# Altium project pira-smart-PCB.PrjPcb (part 2 of 3)
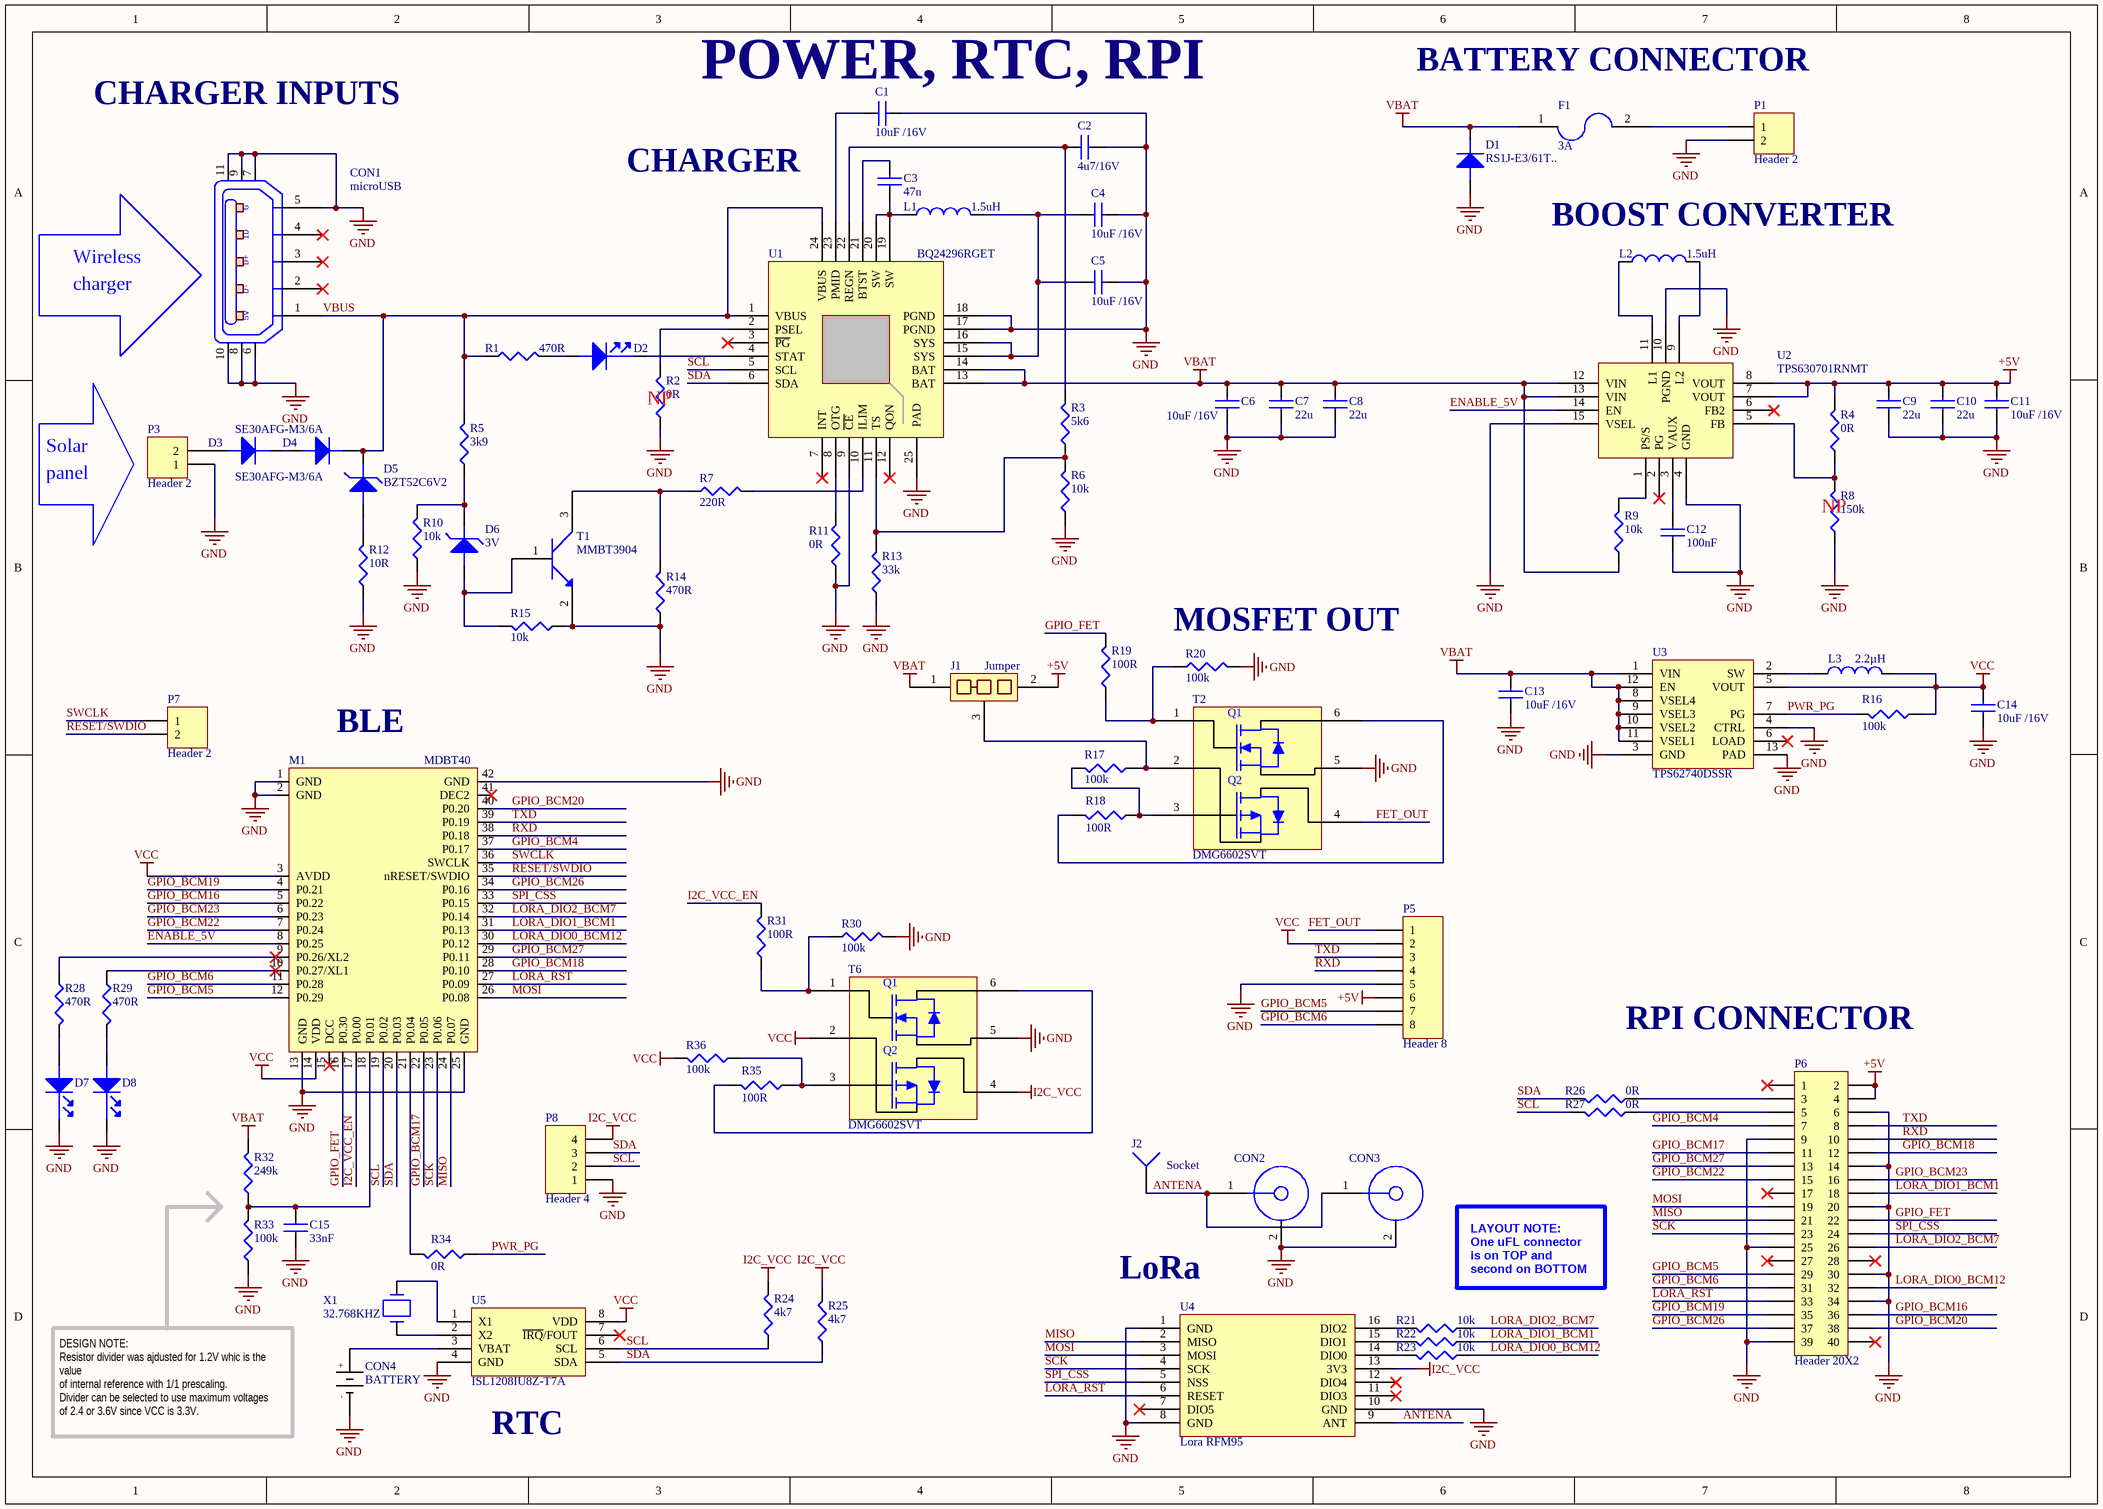
[diagram p2: PAGE2-BLE, POWER, LORA.SchDoc]

## Sheet PAGE2-BLE, POWER, LORA.SchDoc (continued)
### Library data of the parts
C1 C4-C6 C11 C13 C14 = 10uF /16V: TDK - CGA4J1X5R1C106K125AC - CAP, MLCC, X5R, 10UF, 16V, 0805; Manufacturer: TDK; Manufacturer Part Number: CGA4J1X5R1C106K125AC; RoHS: YES; ComponentLink1URL: http://bcove.me/e1v54mtm; ComponentLink1Description: http://bcove.me/e1v54mtm; ComponentLink2URL: http://www.farnell.com/datasheets/1936565.pdf; ComponentLink2Description: http://www.farnell.com/datasheets/1936565.pdf; ComponentLink3URL: http://www.farnell.com/datasheets/1683658.pdf; ComponentLink3Description: http://www.farnell.com/datasheets/1683658.pdf; Supplier 1: Farnell
  C1 C4-C6 C11: Supplier Part Number 1: 2320856
  C13 C14: Stock 1: 8974; Pricing 1: 5=0.41, 50=0.146, 250=0.131, 500=0.12, 1000=0.103 (GBP); Supplier Part Number 1: 2210948RL
C2 = 4u7  16V 0603: MURATA - GRM188R61C475KAAJD - CAP, MLCC, X5R, 4.7UF, 16V, 0603; Ceramic Capacitor Case: 0603 [1608 Metric]; Capacitance: 4.7; Voltage Rating: 16; Capacitance Tolerance: ± 10%; Dielectric Characteristic: X5; Product Range: GRM Series; SVHC: No SVHC (17-Dec-2015)<!--FANDB--><div class="features-and-benefits-container"><div class="features-and-benefits-desc-container"><span class="features-and-benefits-container-desc">SMD Multilayer Ceramic Capacitor, 0603 [1608 Metric], 4.7 µF, 16 V, ± 10%, X5; Supplier 1: Farnell; Manufacturer: MURATA; Manufacturer Part Number: GRM188R61C475KAAJD; RoHS: YES; Stock 1: 5038; Pricing 1: 10=0.16, 100=0.0929, 500=0.076, 1000=0.0618, 2000=0.0605, 4000=0.0425, 20000=0.0409, 40000=0.0355 (GBP); Packaging: Cut Tape; Operating Temperature Min: -55; Operating Temperature Max: 85; Automotive Qualification Standard: -; MSL: MSL 1 - Unlimited; ComponentLink1URL: http://www.farnell.com/datasheets/2079168.pdf; ComponentLink1Description: http://www.farnell.com/datasheets/2079168.pdf; Supplier Part Number 1: 2611924
C3 = 47nF / 50V: MULTICOMP - MC0603B473K500CT - CAP, MLCC, X7R, 47NF, 50V, 0603; Supplier 1: Farnell; Manufacturer: MULTICOMP; Manufacturer Part Number: MC0603B473K500CT; RoHS: YES; Stock 1: 34893; Pricing 1: 10=0.0102, 100=0.0086, 500=0.0069, 1000=0.0059, 2000=0.0051 (GBP); ComponentLink1URL: http://www.farnell.com/datasheets/1901289.pdf; ComponentLink1Description: http://www.farnell.com/datasheets/1901289.pdf; Supplier Part Number 1: 1759116
C7-C10 = 22u 6.3V 0805: MULTICOMP - MC0805X226M6R3CT - CAP, MLCC, X5R, 22UF, 0805; Ceramic Capacitor Case: 0805 [2012 Metric]; Capacitance: 22; Voltage Rating: 6.3; Capacitance Tolerance: ± 20%; Dielectric Characteristic: X5; Product Range: MC Series; SVHC: No SVHC (07-Jul-2017); Capacitor Terminals: SMD; Supplier 1: Farnell; Manufacturer: MULTICOMP; Manufacturer Part Number: MC0805X226M6R3CT; RoHS: YES; Stock 1: 74736; Pricing 1: 5=0.128, 50=0.0738, 250=0.0507, 500=0.042, 1500=0.0358 (GBP); Packaging: Cut Tape; Operating Temperature Min: -55; Operating Temperature Max: 85; Automotive Qualification Standard: -; MSL: -; Capacitance Tolerance ±: ± 20%; Operating Temperature Range: -55°C to +85°C<!--FANDB--><div class="features-and-benefits-container"><div class="features-and-benefits-desc-container"><span class="features-and-benefits-container-desc">SMD Multilayer Ceramic Capacitor, 0805 [2012 Metric], 22 µF, 6.3 V, ± 20%, X5R, MC Series</span></div><div class="features-and-benefits-description"><span class="features-benefits-value">The Multicomp MC series is general purpose MLCC capacitors with X5R dielectric material which provides high electrical precision, stability and reliability. This MLCC capacitor consists of a conducting material and electrodes with high density and high efficiency ceramic condensers.</span></div><div class="features-and-benefits-list"><ul class="features-and-benefits-list-list"><li class="features-and-benefits-list-item">Small size with higher capacitance values</li><li class="features-and-benefits-list-item">0201, 0402, 0603, 0805, 1206, 1210, 1812 case sizes available</li><li class="features-and-benefits-list-item">Capacitance value ranging from 100pF to 220?F</li><li class="features-and-benefits-list-item">Capacitor with lead free termination (pure Tin)</li><li class="features-and-benefits-list-item">High electrical precision, stability and reliability</li><li class="features-and-benefits-list-item">Rated voltage of 4V, 6.3V, 10V, 16V, 25V, 50V</li><li class="features-and-benefits-list-item">Operating temperature of -55°C to +85°C</li><li class="features-and-benefits-list-item">Available in ±10% and ±20; ComponentLink1URL: http://www.farnell.com/datasheets/1901289.pdf; ComponentLink1Description: http://www.farnell.com/datasheets/1901289.pdf; ComponentLink2URL: http://www.farnell.com/datasheets/1932399.pdf; ComponentLink2Description: http://www.farnell.com/datasheets/1932399.pdf; Supplier Part Number 1: 1759415
C12 = 100nF: MURATA - GRM188R71C104KA01J - CAP, MLCC, X7R, 0.1UF, 16V, 0603; Ceramic Capacitor Case: 0603 [1608 Metric]; Capacitance: 0.1; Voltage Rating: 16; Capacitance Tolerance: ± 10%; Dielectric Characteristic: X7; Product Range: GRM Series; SVHC: No SVHC (20-Jun-2016; Supplier 1: Farnell; Manufacturer: MURATA; Manufacturer Part Number: GRM188R71C104KA01J; RoHS: YES; Stock 1: 18297; Pricing 1: 10=0.0145, 100=0.0126, 500=0.0081, 2500=0.0059, 5000=0.0052, 10000=0.0046, 50000=0.0036, 100000=0.0035 (GBP); Packaging: Cut Tape; Operating Temperature Min: -55; Operating Temperature Max: 125; Automotive Qualification Standard: -; MSL: MSL 1 - Unlimited; ComponentLink1URL: http://www.farnell.com/datasheets/2189124.pdf; ComponentLink1Description: http://www.farnell.com/datasheets/2189124.pdf; Supplier Part Number 1: 2688519
C15 = 33nF: MULTICOMP   MC0603B333K250CT   Multilayer Ceramic Capacitor, MC Series, 0.033 F,  10%, X7R, 25 V, 0603 [1608 Metric]; SVHC: To Be Advised; Voltage Rating: 25V; Capacitor Terminals: SMD; Supplier 1: Farnell; Manufacturer: Multicomp; Manufacturer Part Number: MC0603B333K250CT; Stock 1: 9606; Pricing 1: 10=0.0225, 100=0.0163, 500=0.0101, 1000=0.0083, 2000=0.007 (EUR); Capacitance: 33nF; Capacitance Tolerance: ± 10%; Dielectric Characteristic: X7R; Capacitor Case Style: 0603 [1608 Metric]; Operating Temperature Min: -55°C; Operating Temperature Max: 125°C; Packaging: Full Reel; MSL: (Not Available); ComponentLink1URL: https://datasheet.ciiva.com/22675/1901289-22675775.pdf; ComponentLink1Description: https://datasheet.ciiva.com/22675/1901289-22675775.pdf
CON1 = Micro USB CHINA 1
CON2 CON3 = U.FL-R-SMT-1(10): HIROSE(HRS) - U.FL-R-SMT-1(10) - RF COAXIAL, U.FL, STRAIGHT JACK, 50OHM; Connector Type: U.FL Coaxial; Coaxial Termination: Surface Mount Vertical; Impedance: 50; Frequency Max: 6; Connector Mounting: PCB Mount; Supplier 1: Farnell; Manufacturer: HIROSE(HRS); Manufacturer Part Number: U.FL-R-SMT-1(10); RoHS: YES; Stock 1: 118146; Pricing 1: 1=0.5, 25=0.49, 100=0.468, 150=0.446, 250=0.424, 1000=0.394 (GBP); Connector Body Style: Straight Jack; Coaxial Cable Types: -; Contact Material: Brass; Contact Plating: Gold Plated Contacts; Product Range: -; Operating Temperature Max: 90; Operating Temperature Min: -40°C<!--FANDB--><div class="features-and-benefits-container"><div class="features-and-benefits-description"><span class="features-benefits-value">The U. FL-R-SMT-1(10) from Hirose is a straight ultra miniature SMT coaxial receptacle. These connectors offer high frequency performance from DC to 6GHz and impedance of 50 ohm to meet the frequency requirements of a wide variety of miniature equipments.</span></div><div class="features-and-benefits-list"><ul class="features-and-benefits-list-list"><li class="features-and-benefits-list-item">Phosphor bronze with gold plated contacts</li><li class="features-and-benefits-list-item">LCP insulator</li><li class="features-and-benefits-list-item">VSWR of 1.3max at 0 to 3GHz</li><li class="features-and-benefits-list-item">Operating temperature range from -40°C to 90; ComponentLink1URL: http://www.farnell.com/cad/2110742.pdf; ComponentLink1Description: http://www.farnell.com/cad/2110742.pdf; ComponentLink2URL: http://bcove.me/8op6hfnt; ComponentLink2Description: http://bcove.me/8op6hfnt; ComponentLink3URL: http://www.farnell.com/datasheets/1947917.pdf; ComponentLink3Description: http://www.farnell.com/datasheets/1947917.pdf; ComponentLink4URL: http://www.farnell.com/cad/2115175.stp; ComponentLink4Description: http://www.farnell.com/cad/2115175.stp; Supplier Part Number 1: 1688077
CON4 = 1066: HOLDER BATT COIN COMPACT 20MM; Manufacturer: Keystone Electronics; Body Material: Nylon,Glass; Number of Batteries: 1; Approvals: UL; Supplier 1: Farnell; Manufacturer Part Number: 1066; Stock 1: 17073; Pricing 1: 1=1, 50=0.97, 100=0.947, 500=0.927, 1000=0.847 (EUR); Mount: Through Hole,Holder,PCB; Contact Plating: Tin; Contact Material: Bronze,Copper,Tin; Material: Bronze; Min Operating Temperature: -50°C; Max Operating Temperature: 145°C; Packaging: Bulk; Number of Cells: 1; Package Quantity: 1; Termination: PC Pin; Diameter: 20mm; REACH SVHC: No SVHC; Lead Free: Lead Free; ComponentLink1URL: https://datasheet.ciiva.com/3/1066-3994.pdf; ComponentLink1Description: https://datasheet.ciiva.com/3/1066-3994.pdf; ComponentLink2URL: https://datasheet.ciiva.com/1391/1718229-1391198.pdf; ComponentLink2Description: https://datasheet.ciiva.com/1391/1718229-1391198.pdf; ComponentLink3URL: https://datasheet.ciiva.com/12342/m60p3-4068-12342995.pdf; ComponentLink3Description: https://datasheet.ciiva.com/12342/m60p3-4068-12342995.pdf; ComponentLink4URL: https://datasheet.ciiva.com/18403/70181436-18403177.pdf; ComponentLink4Description: https://datasheet.ciiva.com/18403/70181436-18403177.pdf; ComponentLink5URL: https://datasheet.ciiva.com/22643/1814063-22643020.pdf; ComponentLink5Description: https://datasheet.ciiva.com/22643/1814063-22643020.pdf; ComponentLink6URL: https://datasheet.ciiva.com/16322/m60-2p3-16322780.pdf; ComponentLink6Description: https://datasheet.ciiva.com/16322/m60-2p3-16322780.pdf; Supplier Part Number 1: 2293258
D1 = RS1J-E3/61T..: VISHAY - RS1J-E3/61T.. - DIODE, FAST, 1A, 600V, SMD; Repetitive Reverse Voltage Vrrm Max: 600; Forward Current If(AV): 1; Diode Configuration: Single; Forward Voltage VF Max: 1.3; Reverse Recovery Time trr Max: 250; Forward Surge Current Ifsm Max: 30; Diode Case Style: DO-214; No. of Pins: 2 Pin; Product Range: RS1; SVHC: No SVHC (15-Jun-2015); Diode Type: Fast Recovery; External Depth: 2.79; External Length / Height: 2.29; External Width: 5.28; Junction Temperature Tj Max: 150; Supplier 1: Farnell; Manufacturer: VISHAY; Manufacturer Part Number: RS1J-E3/61T..; RoHS: YES; Stock 1: 4705; Pricing 1: 10=0.164, 100=0.111, 200=0.093, 500=0.0847, 1000=0.083, 3000=0.0813, 9000=0.0796, 30000=0.0779 (GBP); Operating Temperature Max: 150; Packaging: Cut Tape; Automotive Qualification Standard: -; Alternate Case Style: DO-214; Current Ifsm: 30; Forward Current If Max: 1; Forward Voltage: 1.3; Operating Temperature Min: -55; Operating Temperature Range: -55°C to +150; Tape Width: 12mm<!--FANDB--><div class="features-and-benefits-container"><div class="features-and-benefits-desc-container"><span class="features-and-benefits-container-desc">Fast / Ultrafast Diode, 600 V, 1 A, Single, 1.3 V, 250 ns, 30 A</span></div><div class="features-and-benefits-description"><span class="features-benefits-value">The RS1J-E3/5AT is a surface-mount Fast Switching Rectifier with solderable matte tin-plated terminals. It is suitable for use in fast switching rectification of power supply, inverters, converters and freewheeling diodes.</span></div><div class="features-and-benefits-list"><ul class="features-and-benefits-list-list"><li class="features-and-benefits-list-item">Colour band denotes cathode end</li><li class="features-and-benefits-list-item">Low-profile package</li><li class="features-and-benefits-list-item">Ideal for automated placement</li><li class="features-and-benefits-list-item">Glass-passivated pallet chip junction</li><li class="features-and-benefits-list-item">Fast switching for high efficiency</li><li class="features-and-benefits-list-item">High forward surge capability</li><li class="features-and-benefits-list-item">Meets MSL level 1 as per J-STD-020, LF maximum peak of 260°C</li><li class="features-and-benefits-list-item">AEC-Q101 qualified</li><li class="features-and-benefits-list-item">UL94V-0 Flammability rating</li></ul></div><div class="features-and-benefits-applications"><ul class="features-and-benefits-value"><li class="features-and-benefits-list-item">Power Management</li><li class="features-and-benefits-list-item">Consumer Electronics</li><li class="features-and-benefits-list-item">Commercial</li><li class="features-and-benefits-list-item">Communications & Networking</li><li class="features-and-benefits-list-item">Automotive</li></ul></div></div>; ComponentLink1URL: http://www.vishay.com/docs/88869/packagin.pdf; ComponentLink1Description: http://www.vishay.com/docs/88869/packagin.pdf; ComponentLink2URL: http://www.vishay.com/doc?88707; ComponentLink2Description: http://www.vishay.com/doc?88707; ComponentLink3URL: http://www.farnell.com/datasheets/2244878.pdf; ComponentLink3Description: http://www.farnell.com/datasheets/2244878.pdf; Supplier Part Number 1: 9550143
D2 D7 D8 = LED RED: BROADCOM LIMITED - HSMS-C190 - LED, RED, 10MCD, 626NM; LED Mounting: SMD; Forward Current If: 20; Forward Voltage: 2.1; Wavelength Typ: 626; Luminous Intensity: 10; Viewing Angle: 170°; Lens Shape: Rectangular; SVHC: No SVHC (17-Dec-2015)<!--FANDB--><div class="features-and-benefits-container"><div class="features-and-benefits-description"><span class="features-benefits-value">The HSMS-C190 is a HER SMD Chip LED with untinted/diffused lens, made of GaP. It is designed in an industry standard package 1.6 x 0.8mm footprint with 0.8mm profile. It is compatible with IR reflow solder processes. The small size and wide viewing angle make this LED prime choices for backlighting applications and front panel illumination especially where space is a premium.</span></div><div class="features-and-benefits-list"><ul class="features-and-benefits-list-list"><li class="features-and-benefits-list-item">Small size</li><li class="features-and-benefits-list-item">Industry standard footprint</li><li class="features-and-benefits-list-item">Compatible with IR solder</li><li class="features-and-benefits-list-item">Diffused optics</li><li class="features-and-benefits-list-item">-40 to 85; Supplier 1: Farnell; Manufacturer: BROADCOM LIMITED; Manufacturer Part Number: HSMS-C190; RoHS: YES; Stock 1: 7534; Pricing 1: 1=0.361, 10=0.256, 50=0.235, 100=0.106, 200=0.101 (GBP); LED Colour: Red; Bulb Size: -; Packaging: Cut Tape; Product Range: -; Automotive Qualification Standard: -; MSL: -; ComponentLink1URL: http://www.farnell.com/datasheets/313031.pdf; ComponentLink1Description: http://www.farnell.com/datasheets/313031.pdf; ComponentLink2URL: http://www.farnell.com/datasheets/1681524.pdf; ComponentLink2Description: http://www.farnell.com/datasheets/1681524.pdf; ComponentLink3URL: http://www.farnell.com/datasheets/2165483.pdf; ComponentLink3Description: http://www.farnell.com/datasheets/2165483.pdf; Supplier Part Number 1: 2497356
D3 D4 = SE30AFG-M3/6A: VISHAY - SE30AFG-M3/6A - RECTIFIER, ESD, 400V, 3A, DO-221AC; Repetitive Reverse Voltage Vrrm Max: 400; Forward Current If(AV): 3; Diode Configuration: Single; Forward Voltage VF Max: 1.1; Reverse Recovery Time trr Max: 1.5; Forward Surge Current Ifsm Max: 40; Diode Case Style: DO-221; No. of Pins: 2; Product Range: SE30; Diode Type: Standard Recovery; Supplier 1: Farnell; Manufacturer: VISHAY; Manufacturer Part Number: SE30AFG-M3/6A; RoHS: YES; Stock 1: 13984; Pricing 1: 1=0.306, 25=0.0765, 100=0.0753, 250=0.0729, 500=0.072, 1000=0.0654 (GBP); Operating Temperature Max: 175; Packaging: Each; Automotive Qualification Standard: -; MSL: MSL 1 - Unlimited; Operating Temperature Min: -55°C<!--FANDB--><div class="features-and-benefits-container"><div class="features-and-benefits-desc-container"><span class="features-and-benefits-container-desc">Standard Recovery Diode, 400 V, 3 A, Single, 1.1 V, 1.5 µs, 40 A</span></div><div class="features-and-benefits-description"><span class="features-benefits-value">The SE30AFG-M3/6A is a surface-mount ESD Capability Rectifier with matte tin-plated solderable leads. It is suitable for use in general-purpose, polarity protection and rail-to-rail protection.</span></div><div class="features-and-benefits-list"><ul class="features-and-benefits-list-list"><li class="features-and-benefits-list-item">Oxide planar chip junction</li><li class="features-and-benefits-list-item">Low forward voltage drop, low leakage current</li><li class="features-and-benefits-list-item">Very low profile - Typical height of 0.95; ComponentLink1URL: http://www.farnell.com/datasheets/2049981.pdf; ComponentLink1Description: http://www.farnell.com/datasheets/2049981.pdf; Supplier Part Number 1: 2313878
D5 = BZT52C6V2: DIODES INC. - BZT52C6V2 - DIODE, ZENER, 6.2V, 0.5W, SOD-123; Zener Voltage Vz Typ: 6.2; Power Dissipation Pd: 500; Zener Tolerance ±: 6%; No. of Pins: 2; Product Range: BZT52 Series; SVHC: No SVHC (12-Jan-2017); Supplier 1: Farnell; Manufacturer: DIODES INC.; Manufacturer Part Number: BZT52C6V2; RoHS: YES; Stock 1: 4408; Pricing 1: 1=0.415, 25=0.264, 100=0.0727, 250=0.0546, 500=0.047, 1000=0.0334, 3000=0.0278, 7000=0.0236 (GBP); Diode Case Style: SOD-123; Operating Temperature Max: 150; Packaging: Cut Tape; Automotive Qualification Standard: -; MSL: MSL 1 - Unlimited; Operating Temperature Min: -65; Operating Temperature Range: -65°C to +150°C<!--FANDB--><div class="features-and-benefits-container"><div class="features-and-benefits-desc-container"><span class="features-and-benefits-container-desc">Zener Single Diode, 6.2 V, 500 mW, SOD-123, 6 %, 2 Pins, 150 °C</span></div><div class="features-and-benefits-description"><span class="features-benefits-value">The BZT52C6V2 is a surface mount Zener Diode with moulded plastic case, matte tin annealed over Alloy 42 lead frame (lead-free plating) terminals and cathode band polarity. It is ideally suited for automated assembly processes.</span></div><div class="features-and-benefits-list"><ul class="features-and-benefits-list-list"><li class="features-and-benefits-list-item">Planar die construction</li><li class="features-and-benefits-list-item">500mW Power dissipation</li><li class="features-and-benefits-list-item">General purpose, medium current</li><li class="features-and-benefits-list-item">Totally lead-free</li><li class="features-and-benefits-list-item">Halogen and antimony-free - Green device</li><li class="features-and-benefits-list-item">Qualified to AEC-Q101 standards for high reliability</li></ul></div><div class="features-and-benefits-applications"><ul class="features-and-benefits-value"><li class="features-and-benefits-list-item">Automation & Process Control</li></ul></div></div>; ComponentLink1URL: http://www.farnell.com/datasheets/1670962.pdf; ComponentLink1Description: http://www.farnell.com/datasheets/1670962.pdf; Supplier Part Number 1: 1902438
D6 = MM3Z3V0T1G: ON SEMICONDUCTOR - MM3Z3V0T1G - ZENER DIODE, 200MW, 3V, SOD-323; Zener Voltage Vz Typ: 3; Power Dissipation Pd: 300; Zener Tolerance ±: 5%; No. of Pins: 2; Product Range: MM3Z3 Series; SVHC: No SVHC (07-Jul-2017); Supplier 1: Farnell; Manufacturer: ON SEMICONDUCTOR; Manufacturer Part Number: MM3Z3V0T1G; RoHS: YES; Stock 1: 6591; Pricing 1: 5=0.126, 50=0.0544, 250=0.0443, 500=0.0288, 1500=0.0274 (GBP); Diode Case Style: SOD-323; Operating Temperature Max: 150; Packaging: Cut Tape; Automotive Qualification Standard: -; MSL: MSL 1 - Unlimited<!--FANDB--><div class="features-and-benefits-container"><div class="features-and-benefits-desc-container"><span class="features-and-benefits-container-desc">Zener Single Diode, 3 V, 300 mW, SOD-323, 5 %, 2 Pins, 150 °C</span></div></div>; ComponentLink1URL: http://www.farnell.com/datasheets/1876691.pdf; ComponentLink1Description: http://www.farnell.com/datasheets/1876691.pdf; ComponentLink2URL: http://www.farnell.com/datasheets/2306645.pdf; ComponentLink2Description: http://www.farnell.com/datasheets/2306645.pdf; Supplier Part Number 1: 2463510
F1 = PTC FUSE 3A: LITTELFUSE - MINISMDC150F/24-2 - POLYSWITCH, SMD, 1812, 1.5A; Supplier 1: Farnell; Manufacturer: LITTELFUSE; Manufacturer Part Number: MINISMDC150F/24-2; RoHS: YES; Stock 1: 9256; Pricing 1: 1=0.463, 50=0.382, 100=0.327, 250=0.302, 500=0.256, 1000=0.254, 5000=0.253, 10000=0.251 (GBP); ComponentLink1URL: http://www.farnell.com/datasheets/2363925.pdf; ComponentLink1Description: http://www.farnell.com/datasheets/2363925.pdf; ComponentLink2URL: http://www.farnell.com/datasheets/2282569.pdf; ComponentLink2Description: http://www.farnell.com/datasheets/2282569.pdf; Supplier Part Number 1: 1345929
L1 L2 = 1.5uH 5.1A: MURATA - FDSD0420-H-1R5M=P3 - INDUCTOR, SHIELDED, 1.5UH, 5.1A, 20%; Product Range: FDSD0420 Series; Inductance: 1.5; RMS Current (Irms): 5.1; Saturation Current (Isat): 7.7; DC Resistance Max: 0.036; Power Inductor Case: 4.2mm x 4.2mm x 2; SVHC: No SVHC (17-Dec-2015); Supplier 1: Farnell; Manufacturer: MURATA; Manufacturer Part Number: FDSD0420-H-1R5M=P3; RoHS: YES; Stock 1: 1471; Pricing 1: 5=0.79, 50=0.448, 250=0.422, 500=0.377, 1000=0.305, 2000=0.298, 10000=0.291, 20000=0.284 (GBP); Inductor Construction: Shielded; Inductance Tolerance: ± 20%; Packaging: Each; MSL: MSL 1 - Unlimited<!--FANDB--><div class="features-and-benefits-container"></div>; ComponentLink1URL: http://www.farnell.com/datasheets/2021980.pdf; ComponentLink1Description: http://www.farnell.com/datasheets/2021980.pdf; Supplier Part Number 1: 2530091
L3 = PFL2015-222MEB: Fixed Inductors PFL2015 Shld Power 2.2 uH 20 % 1 A; Manufacturer: Coilcraft; SVHC: To Be Advised; Product Range: Coilcraft - PFL2015 Series; Inductance Tolerance: ± 20%; DC Resistance Max: 0.21ohm; DC Current Rating: 1A; Self Resonant Frequency: 100MHz; Inductor Case Style: SMD; Core Material: (Not Applicable); Supplier 1: Farnell; Manufacturer Part Number: PFL2015-222MEB; Stock 1: 3300; Pricing 1: 1=0.475, 200=0.383, 500=0.333 (EUR); Inductance: 2.2µH; ComponentLink1URL: https://datasheet.ciiva.com/22701/1681966-22701687.pdf; ComponentLink1Description: https://datasheet.ciiva.com/22701/1681966-22701687.pdf; ComponentLink2URL: https://datasheet.ciiva.com/22679/1681966-22679157.pdf; ComponentLink2Description: https://datasheet.ciiva.com/22679/1681966-22679157.pdf
P1 P3 P7 = Header 2: Header, 2-Pin; LatestRevisionDate: 17-Jul-2002; LatestRevisionNote: Re-released for DXP Platform.; Publisher: Altium Limited
P5 = Header 8: Header, 8-Pin; LatestRevisionDate: 17-Jul-2002; LatestRevisionNote: Re-released for DXP Platform.; Publisher: Altium Limited
P6 = Header 20X2: Header, 20-Pin, Dual row; LatestRevisionDate: 17-Jul-2002; LatestRevisionNote: Re-released for DXP Platform.; Publisher: Altium Limited
P8 = Header 4: Header, 4-Pin; LatestRevisionDate: 17-Jul-2002; LatestRevisionNote: Re-released for DXP Platform.; Publisher: Altium Limited
R1 R14 R28 R29 = 470R: MULTICOMP - MCMR06X471 JTL - RES, CERAMIC, 470R, 5%, 0.1W, 0603; Supplier 1: Farnell; Manufacturer: MULTICOMP; Manufacturer Part Number: MCMR06X471 JTL; RoHS: Y-EX; Stock 1: 3786; Pricing 1: 10=0.0089, 100=0.0076, 500=0.0063, 1000=0.0049, 2500=0.0033, 5000=0.0024, 25000=0.0016, 50000=0.0013 (GBP); ComponentLink1URL: http://www.farnell.com/datasheets/1716707.pdf; ComponentLink1Description: http://www.farnell.com/datasheets/1716707.pdf; Supplier Part Number 1: 2073513
R2 R4 R11 R26 R27 R34 = 0R: BOURNS - CR0603-J/-000ELF - RES, THICK FILM, 0R, 5%, 0.1W, 0603; Resistance: 0; Voltage Rating: 50; Resistor Case Style: 0603 [1608 Metric]; Power Rating: 100; Product Range: CR Series; SVHC: No SVHC (17-Dec-2015); Resistor Mounting: Surface Mount Device<!--FANDB--><div class="features-and-benefits-container"><div class="features-and-benefits-description"><span class="features-benefits-value">The Bourns CR series are standard thick film chip resistors. These resistors provide flexibility of performance, space saving and low cost. The Resistance range includes E96 and E24 decade values from 1ohm to 10Mohm.</span></div><div class="features-and-benefits-list"><ul class="features-and-benefits-list-list"><li class="features-and-benefits-list-item">0201, 0402, 0603, 0805, 1206, 1210, 2010, 2512 standard case sizes available</li><li class="features-and-benefits-list-item">±1% and ±5% tolerance</li><li class="features-and-benefits-list-item">±100ppm/°C, ±200ppm/°C and ±250ppm/°C TCR values available</li><li class="features-and-benefits-list-item">Power rating selectable for 50mW, 63mW, 0.1W, 0.125W, 0.25W, 0.5W and 1W based on ordering</li><li class="features-and-benefits-list-item">Jumpers are available for all size</li><li class="features-and-benefits-list-item">3 layer termination process with nickel barrier prevents leaching & provides excellent solderability</li><li class="features-and-benefits-list-item">Suitable for all type of soldering processes</li><li class="features-and-benefits-list-item">Tight dimensional tolerances</li><li class="features-and-benefits-list-item">Maximum working voltage depends on case size</li><li class="features-and-benefits-list-item">Operating temperature of -55°C to +125°C(CR0201) and -55°C to +155; Supplier 1: Farnell; Manufacturer: BOURNS; Manufacturer Part Number: CR0603-J/-000ELF; RoHS: YES; Stock 1: 58200; Pricing 1: 10=0.0146, 250=0.0097, 1000=0.0073, 5000=0.0049, 12500=0.0042 (GBP); Resistance Tolerance: ± 5%; Packaging: Cut Tape; Resistor Element Material: Thick Film; Temperature Coefficient: -; Automotive Qualification Standard: -; MSL: MSL 1 - Unlimited; ComponentLink1URL: http://www.bourns.com/engineering/CHPREZTR/cr0603.stp; ComponentLink1Description: http://www.bourns.com/engineering/CHPREZTR/cr0603.stp; ComponentLink2URL: http://www.farnell.com/datasheets/2178762.pdf; ComponentLink2Description: http://www.farnell.com/datasheets/2178762.pdf; Supplier Part Number 1: 2008343
R3 = 5k6: MULTICOMP - MCMR06X5601FTL - RES, CERAMIC, 5K6, 1%, 0.1W, 0603; Resistance: 5.6; Voltage Rating: 75; Resistor Case Style: 0603 [1608 Metric]; Power Rating: 100; Product Range: MCMR Series; Temperature Coefficient: ± 100; SVHC: No SVHC (07-Jul-2017); Resistor Mounting: Surface Mount Device<!--FANDB--><div class="features-and-benefits-container"><div class="features-and-benefits-desc-container"><span class="features-and-benefits-container-desc">SMD Chip Resistor, Ceramic, 5.6 kohm, 75 V, 0603 [1608 Metric], 100 mW, ± 1%, MCMR Series</span></div><div class="features-and-benefits-description"><span class="features-benefits-value">The Multicomp MCMR series resistors are automotive grade, anti sulphured thick film chip resistor. The resistance range includes E24 and E96 decade values from 1ohm to 10Mohm. These resistors are constructed on top of a high grade ceramic body.</span></div><div class="features-and-benefits-list"><ul class="features-and-benefits-list-list"><li class="features-and-benefits-list-item">EIA 0402, 0603, 0805, 1206 chip sizes available</li><li class="features-and-benefits-list-item">High reliability and stability</li><li class="features-and-benefits-list-item">Automotive grade AEC-Q200 compliant</li><li class="features-and-benefits-list-item">Complaint with (IEC 60068-1) 55/155/56 climatic category</li><li class="features-and-benefits-list-item">Maximum operation voltage of 50V, 75V, 150V and 200V</li><li class="features-and-benefits-list-item">Power rating of 62.5mW, 100mW, 125mW and 250mW</li><li class="features-and-benefits-list-item">Available in ±1% and ±5% tolerance</li><li class="features-and-benefits-list-item">Temperature coefficient (TCR) of +200ppm/°C, +100ppm/°C and -200ppm/°C to +400ppm/°C</li><li class="features-and-benefits-list-item">Operating temperature range -55°C to 155; Supplier 1: Farnell; Manufacturer: MULTICOMP; Manufacturer Part Number: MCMR06X5601FTL; RoHS: Y-EX; Stock 1: 9135; Pricing 1: 10=0.0088, 100=0.0053, 500=0.0037, 1000=0.0029, 2500=0.0024 (GBP); Resistance Tolerance: ± 1%; Packaging: Cut Tape; Resistor Element Material: Ceramic; Automotive Qualification Standard: -; ComponentLink1URL: http://www.farnell.com/datasheets/1716707.pdf; ComponentLink1Description: http://www.farnell.com/datasheets/1716707.pdf; Supplier Part Number 1: 2073537
R5 = 3k9: MULTICOMP - MCWR06X3901FTL - RES, THICK FILM, 3K9, 1%, 0.1W, 0603; Resistance: 3.9; Voltage Rating: 50; Resistor Case Style: 0603 [1608 Metric]; Power Rating: 100; Product Range: MCWR Series; Temperature Coefficient: ± 100; SVHC: No SVHC (07-Jul-2017)<!--FANDB--><div class="features-and-benefits-container"><div class="features-and-benefits-desc-container"><span class="features-and-benefits-container-desc">SMD Chip Resistor, Thick Film, 3.9 kohm, 50 V, 0603 [1608 Metric], 100 mW, ± 1; Supplier 1: Farnell; Manufacturer: MULTICOMP; Manufacturer Part Number: MCWR06X3901FTL; RoHS: Y-EX; Stock 1: 19057; Pricing 1: 10=0.0032, 100=0.002, 500=0.0013, 1000=0.0011, 2500=0.0009 (GBP); Resistance Tolerance: ± 1%; Packaging: Cut Tape; Resistor Element Material: Thick Film; Automotive Qualification Standard: -; ComponentLink1URL: http://www.farnell.com/datasheets/1849611.pdf; ComponentLink1Description: http://www.farnell.com/datasheets/1849611.pdf; Supplier Part Number 1: 2447363
R6 R9 R10 R15 R21-R23 = 10k: MULTICOMP - MCMR06X103 JTL - RES, CERAMIC, 10K, 5%, 0.1W, 0603; Resistance: 10; Voltage Rating: 75; Resistor Case Style: 0603 [1608 Metric]; Power Rating: 100; Product Range: MCMR Series; Temperature Coefficient: ± 100; Automotive Qualification Standard: -<!--FANDB--><div class="features-and-benefits-container"><div class="features-and-benefits-description"><span class="features-benefits-value">The Multicomp MCMR series resistors are automotive grade, anti sulphured thick film chip resistor. The resistance range includes E24 and E96 decade values from 1ohm to 10Mohm. These resistors are constructed on top of a high grade ceramic body.</span></div><div class="features-and-benefits-list"><ul class="features-and-benefits-list-list"><li class="features-and-benefits-list-item">EIA 0402, 0603, 0805, 1206 chip sizes available</li><li class="features-and-benefits-list-item">High reliability and stability</li><li class="features-and-benefits-list-item">Automotive grade AEC-Q200 compliant</li><li class="features-and-benefits-list-item">Complaint with (IEC 60068-1) 55/155/56 climatic category</li><li class="features-and-benefits-list-item">Maximum operation voltage of 50V, 75V, 150V and 200V</li><li class="features-and-benefits-list-item">Power rating of 62.5mW, 100mW, 125mW and 250mW</li><li class="features-and-benefits-list-item">Available in ±1% and ±5% tolerance</li><li class="features-and-benefits-list-item">Temperature coefficient (TCR) of +200ppm/°C, +100ppm/°C and -200ppm/°C to +400ppm/°C</li><li class="features-and-benefits-list-item">Operating temperature range -55°C to 155; Supplier 1: Farnell; Manufacturer: MULTICOMP; Manufacturer Part Number: MCMR06X103 JTL; RoHS: Y-EX; Stock 1: 19791; Pricing 1: 10=0.0087, 100=0.0074, 500=0.0061, 1000=0.0048, 2500=0.0032, 5000=0.0024, 25000=0.0016, 50000=0.0013 (GBP); Resistance Tolerance: ± 5%; Packaging: Cut Tape; Resistor Element Material: Ceramic; ComponentLink1URL: http://www.farnell.com/datasheets/1716707.pdf; ComponentLink1Description: http://www.farnell.com/datasheets/1716707.pdf; Supplier Part Number 1: 2073356
R7 = 220R: MULTICOMP - MCWR06X2200FTL - RES, THICK FILM, 220R, 1%, 0.1W, 0603; Resistance: 220; Voltage Rating: 50; Resistor Case Style: 0603 [1608 Metric]; Power Rating: 100; Product Range: MCWR Series; Temperature Coefficient: ± 100; SVHC: No SVHC (07-Jul-2017)<!--FANDB--><div class="features-and-benefits-container"><div class="features-and-benefits-desc-container"><span class="features-and-benefits-container-desc">SMD Chip Resistor, Thick Film, 220 ohm, 50 V, 0603 [1608 Metric], 100 mW, ± 1; Supplier 1: Farnell; Manufacturer: MULTICOMP; Manufacturer Part Number: MCWR06X2200FTL; RoHS: Y-EX; Stock 1: 124834; Pricing 1: 10=0.0031, 100=0.0018, 500=0.0013, 1000=0.001, 2500=0.0008 (GBP); Resistance Tolerance: ± 1%; Packaging: Cut Tape; Resistor Element Material: Thick Film; Automotive Qualification Standard: -; ComponentLink1URL: http://www.farnell.com/datasheets/1849611.pdf; ComponentLink1Description: http://www.farnell.com/datasheets/1849611.pdf; Supplier Part Number 1: 2447298
R8 = 150k: MULTICOMP - MCWR06X1503FTL - RES, THICK FILM, 150KOHM, 1%, 0.1W; Resistance: 150; Voltage Rating: 50; Resistor Case Style: 0603 [1608 Metric]; Power Rating: 100; Product Range: MCWR Series; Temperature Coefficient: ± 100; SVHC: No SVHC (07-Jul-2017)<!--FANDB--><div class="features-and-benefits-container"><div class="features-and-benefits-desc-container"><span class="features-and-benefits-container-desc">SMD Chip Resistor, Thick Film, 150 kohm, 50 V, 0603 [1608 Metric], 100 mW, ± 1; Supplier 1: Farnell; Manufacturer: MULTICOMP; Manufacturer Part Number: MCWR06X1503FTL; RoHS: Y-EX; Stock 1: 11455; Pricing 1: 10=0.0033, 100=0.002, 500=0.0014, 1000=0.0011, 2500=0.0009 (GBP); Resistance Tolerance: ± 1%; Packaging: Cut Tape; Resistor Element Material: Thick Film; Automotive Qualification Standard: -; ComponentLink1URL: http://www.farnell.com/datasheets/1849611.pdf; ComponentLink1Description: http://www.farnell.com/datasheets/1849611.pdf; Supplier Part Number 1: 2447254
R12 = 10R: VISHAY - RCA060310R0FKEA - RES, AUTO, THICK FILM, 10R, 1%, 0603; Resistance: 10; Voltage Rating: 75; Resistor Case Style: 0603 [1608 Metric]; Power Rating: 100; Product Range: RCA Series; Temperature Coefficient: ± 100; Automotive Qualification Standard: AEC-Q200; SVHC: No SVHC (17-Dec-2015)<!--FANDB--><div class="features-and-benefits-container"><div class="features-and-benefits-description"><span class="features-benefits-value">The RCA series from Vishay are automotive grade, sulphur resistant thick film rectangular chip resistors. The resistance range includes E24 and E96 decade values from 1ohm to 10Mohm. They provide superior resistance against H2S atmosphere. These resistors have metal glaze on high quality ceramic.</span></div><div class="features-and-benefits-list"><ul class="features-and-benefits-list-list"><li class="features-and-benefits-list-item">Automotive grade AEC-Q200 qualified (rev C)</li><li class="features-and-benefits-list-item">EIA 0402, 0603, 0805, 1206, 1210, 1218, 2010 and 2512 case sizes available</li><li class="features-and-benefits-list-item">Available in ±0.5%, ±1% and ±5% tolerances</li><li class="features-and-benefits-list-item">Jumpers are also available</li><li class="features-and-benefits-list-item">±50ppm/K, ±100ppm/K and ±200ppm/K TCR values</li><li class="features-and-benefits-list-item">Power rating of 0.063W, 0.10W, 0.125W, 0.25W, 0.5W, 0.75W and 1W at 70?C</li><li class="features-and-benefits-list-item">Available in 50V, 75V, 150V, 200V, 400V and 500V limiting voltage options</li><li class="features-and-benefits-list-item">Category temperature range from -55?C to 155?C</li><li class="features-and-benefits-list-item">Stability ?R/R = 1 % for 1000h at 70; Supplier 1: Farnell; Manufacturer: VISHAY; Manufacturer Part Number: RCA060310R0FKEA; RoHS: YES; Stock 1: 9559; Pricing 1: 10=0.0803, 100=0.0386, 500=0.0235, 2500=0.015, 5000=0.0135, 10000=0.0108, 50000=0.0068, 100000=0.0067 (GBP); Resistance Tolerance: ± 1%; Packaging: Cut Tape; Resistor Element Material: Thick Film; ComponentLink1URL: http://www.farnell.com/datasheets/2111201.pdf; ComponentLink1Description: http://www.farnell.com/datasheets/2111201.pdf; Supplier Part Number 1: 2616585
R13 = 33k: MULTICOMP - MCWR06X3302FTL - RES, THICK FILM, 33K, 1%, 0.1W, 0603; Resistance: 33; Voltage Rating: 50; Resistor Case Style: 0603 [1608 Metric]; Power Rating: 100; Product Range: MCWR Series; Temperature Coefficient: ± 100; SVHC: No SVHC (07-Jul-2017)<!--FANDB--><div class="features-and-benefits-container"><div class="features-and-benefits-desc-container"><span class="features-and-benefits-container-desc">SMD Chip Resistor, Thick Film, 33 kohm, 50 V, 0603 [1608 Metric], 100 mW, ± 1; Supplier 1: Farnell; Manufacturer: MULTICOMP; Manufacturer Part Number: MCWR06X3302FTL; RoHS: Y-EX; Stock 1: 10138; Pricing 1: 10=0.0033, 100=0.002, 500=0.0014, 1000=0.0011, 2500=0.0009 (GBP); Resistance Tolerance: ± 1%; Packaging: Cut Tape; Resistor Element Material: Thick Film; Automotive Qualification Standard: -; ComponentLink1URL: http://www.farnell.com/datasheets/1849611.pdf; ComponentLink1Description: http://www.farnell.com/datasheets/1849611.pdf; Supplier Part Number 1: 2447342
R16 R17 R20 R30 R33 R36 = 100k: MULTICOMP - MCMR06X104 JTL - RES, CERAMIC, 100K, 5%, 0.1W, 0603; Resistance: 100; Voltage Rating: 75; Resistor Case Style: 0603 [1608 Metric]; Product Range: MCMR Series; Temperature Coefficient: ± 100; Resistor Mounting: Surface Mount Device<!--FANDB--><div class="features-and-benefits-container"><div class="features-and-benefits-description"><span class="features-benefits-value">The Multicomp MCMR series resistors are automotive grade, anti sulphured thick film chip resistor. The resistance range includes E24 and E96 decade values from 1ohm to 10Mohm. These resistors are constructed on top of a high grade ceramic body.</span></div><div class="features-and-benefits-list"><ul class="features-and-benefits-list-list"><li class="features-and-benefits-list-item">EIA 0402, 0603, 0805, 1206 chip sizes available</li><li class="features-and-benefits-list-item">High reliability and stability</li><li class="features-and-benefits-list-item">Automotive grade AEC-Q200 compliant</li><li class="features-and-benefits-list-item">Complaint with (IEC 60068-1) 55/155/56 climatic category</li><li class="features-and-benefits-list-item">Maximum operation voltage of 50V, 75V, 150V and 200V</li><li class="features-and-benefits-list-item">Power rating of 62.5mW, 100mW, 125mW and 250mW</li><li class="features-and-benefits-list-item">Available in ±1% and ±5% tolerance</li><li class="features-and-benefits-list-item">Temperature coefficient (TCR) of +200ppm/°C, +100ppm/°C and -200ppm/°C to +400ppm/°C</li><li class="features-and-benefits-list-item">Operating temperature range -55°C to 155; Supplier 1: Farnell; Manufacturer: MULTICOMP; Manufacturer Part Number: MCMR06X104 JTL; RoHS: Y-EX; Stock 1: 187; Pricing 1: 10=0.0109, 100=0.0085, 500=0.006, 1000=0.0048, 2500=0.004, 5000=0.003, 25000=0.002, 50000=0.0016 (GBP); Power Rating: 100; Resistance Tolerance: ± 5%; Packaging: Cut Tape; Resistor Element Material: Ceramic; Automotive Qualification Standard: -; ComponentLink1URL: http://www.farnell.com/datasheets/1716707.pdf; ComponentLink1Description: http://www.farnell.com/datasheets/1716707.pdf; Supplier Part Number 1: 2073357
R18 R19 R31 R35 = 100R: MULTICOMP - MC0063W06031100R - RES, THICK FILM, 100R, 1%, 0.063W, 0603; Resistance: 100; Voltage Rating: 50; Resistor Case Style: 0603 [1608 Metric]; Power Rating: 63; Product Range: MC Series; Temperature Coefficient: ± 200; SVHC: No SVHC (12-Jan-2017); External Depth: 0.45; External Length / Height: 1.6; External Width: 0.8; No. of Pins: 2; Reel Quantity: 5000; Resistor Mounting: Surface Mount Device; Temperature Coeff. +: 200; Voltage Rating V DC: 50V<!--FANDB--><div class="features-and-benefits-container"><div class="features-and-benefits-description"><span class="features-benefits-value">The Multicomp MC series current sense resistors are thick film chip resistors. The resistance range includes E96 and E24 decade values from 1ohm to 10Mohm.</span></div><div class="features-and-benefits-list"><ul class="features-and-benefits-list-list"><li class="features-and-benefits-list-item">EIA 0402, 0603, 0805, 1206 chip sizes available</li><li class="features-and-benefits-list-item">Small size and low weight</li><li class="features-and-benefits-list-item">Suitable for both wave and reflow soldering</li><li class="features-and-benefits-list-item">Reduction of assembly costs</li><li class="features-and-benefits-list-item">Maximum working voltage of 50V(0402, 0603), 150V(0805), 200V(1206)</li><li class="features-and-benefits-list-item">Available in ±1%, ±2% and ±5% tolerance</li><li class="features-and-benefits-list-item">Power rating of 62.5mW, 100mW and 125mW</li><li class="features-and-benefits-list-item">±400ppm/°C(1ohm to 10ohm), ±200ppm/°C(11ohm to 100ohm), ±100; Manufacturer: MULTICOMP; Manufacturer Part Number: MC0063W06031100R; RoHS: Y-EX; Resistance Tolerance: ± 1%; Packaging: Cut Tape; Resistor Element Material: Thick Film; Automotive Qualification Standard: -; Operating Temperature Max: 155; Operating Temperature Min: -55; Operating Temperature Range: -55°C to +155; Tape Width: 8; Temperature Coeff. -: 200; Tolerance +: 1%; Tolerance -: 1%; ComponentLink1URL: http://www.farnell.com/datasheets/1788326.pdf; ComponentLink1Description: http://www.farnell.com/datasheets/1788326.pdf; ComponentLink2URL: http://www.farnell.com/cad/1561149.zip; ComponentLink2Description: http://www.farnell.com/cad/1561149.zip; ComponentLink3URL: http://www.farnell.com/datasheets/2289252.pdf; ComponentLink3Description: http://www.farnell.com/datasheets/2289252.pdf; Supplier 1: Farnell; Supplier Part Number 1: 2447227
R24 R25 = 4k7: MULTICOMP - MCMR06X4701FTL - RES, CERAMIC, 4K7, 1%, 0.1W, 0603; Resistance: 4.7; Voltage Rating: 75; Resistor Case Style: 0603 [1608 Metric]; Power Rating: 100; Product Range: MCMR Series; Temperature Coefficient: ± 100; SVHC: No SVHC (12-Jan-2017)<!--FANDB--><div class="features-and-benefits-container"><div class="features-and-benefits-description"><span class="features-benefits-value">The Multicomp MCMR series resistors are automotive grade, anti sulphured thick film chip resistor. The resistance range includes E24 and E96 decade values from 1ohm to 10Mohm. These resistors are constructed on top of a high grade ceramic body.</span></div><div class="features-and-benefits-list"><ul class="features-and-benefits-list-list"><li class="features-and-benefits-list-item">EIA 0402, 0603, 0805, 1206 chip sizes available</li><li class="features-and-benefits-list-item">High reliability and stability</li><li class="features-and-benefits-list-item">Automotive grade AEC-Q200 compliant</li><li class="features-and-benefits-list-item">Complaint with (IEC 60068-1) 55/155/56 climatic category</li><li class="features-and-benefits-list-item">Maximum operation voltage of 50V, 75V, 150V and 200V</li><li class="features-and-benefits-list-item">Power rating of 62.5mW, 100mW, 125mW and 250mW</li><li class="features-and-benefits-list-item">Available in ±1% and ±5% tolerance</li><li class="features-and-benefits-list-item">Temperature coefficient (TCR) of +200ppm/°C, +100ppm/°C and -200ppm/°C to +400ppm/°C</li><li class="features-and-benefits-list-item">Operating temperature range -55°C to 155; Supplier 1: Farnell; Manufacturer: MULTICOMP; Manufacturer Part Number: MCMR06X4701FTL; RoHS: Y-EX; Stock 1: 218618; Pricing 1: 10=0.0085, 100=0.0051, 500=0.0036, 1000=0.0028, 2500=0.0023 (GBP); Resistance Tolerance: ± 1%; Packaging: Cut Tape; Resistor Element Material: Ceramic; Automotive Qualification Standard: -; ComponentLink1URL: http://www.farnell.com/datasheets/1716707.pdf; ComponentLink1Description: http://www.farnell.com/datasheets/1716707.pdf; Supplier Part Number 1: 2073509
R32 = 249k: MULTICOMP         MCWR06X2493FTL             SMD Chip Resistor, Thick Film, 249 kohm, 50 V, 0603 [1608 Metric], 100 mW,  1%, MCWR Series; Voltage Rating: 50V; Power Rating: 100mW; Temperature Coefficient: ± 100ppm/°C; SVHC: No SVHC (17-Dec-2015); Supplier 1: Farnell; Manufacturer: Multicomp; Manufacturer Part Number: MCWR06X2493FTL; Stock 1: 5347; Pricing 1: 10=0.0035, 100=0.0021, 500=0.0015, 1000=0.0012, 2500=0.001 (EUR); Resistance: 249kohm; Resistor Case Style: 0603 [1608 Metric]; Resistance Tolerance: ± 1%; Product Range: MCWR Series; Packaging: Cut Tape; Resistor Element Type: Thick Film; Automotive Qualification Standard: -; MSL: -; ComponentLink1URL: http://www.farnell.com/datasheets/1849611.pdf; ComponentLink1Description: http://www.farnell.com/datasheets/1849611.pdf; Supplier Part Number 1: 2447306
T1 = MMBT3904: ON SEMICONDUCTOR/FAIRCHILD - MMBT3904 - TRANSISTOR, NPN, SOT-23; Collector Emitter Voltage V(br)ceo: 40; Transition Frequency ft: 300; Power Dissipation Pd: 350; DC Collector Current: 200; No. of Pins: 3; SVHC: No SVHC (15-Jun-2015); Current Ic hFE: 10; Device Marking: BT3904; Hfe Min: 100; No. of Transistors: 1; Noise Factor Max: 5; Voltage Vcbo: 60V<!--FANDB--><div class="features-and-benefits-container"><div class="features-and-benefits-description"><span class="features-benefits-value">The MMBT3904 from Fairchild is a surface mount, NPN general purpose amplifier in SOT-23 package. This device is suitable for general purpose amplification and switching applications.</span></div><div class="features-and-benefits-list"><ul class="features-and-benefits-list-list"><li class="features-and-benefits-list-item">Collector to emitter voltage (Vce) of 40V</li><li class="features-and-benefits-list-item">Collector to emitter saturation voltage of 300mV at 50mA collector current</li><li class="features-and-benefits-list-item">Power dissipation of 350mW</li><li class="features-and-benefits-list-item">DC collector current of 200mA</li><li class="features-and-benefits-list-item">DC current gain of 30 at Ic=100mA</li><li class="features-and-benefits-list-item">Operating junction temperature range from -55°C to 150; Supplier 1: Farnell; Manufacturer: ON SEMICONDUCTOR/FAIRCHILD; Manufacturer Part Number: MMBT3904; RoHS: YES; Stock 1: 54090; Pricing 1: 5=0.121, 50=0.043, 250=0.0401, 500=0.0261, 1500=0.0256 (GBP); Transistor Polarity: NPN; DC Current Gain hFE: 300; Transistor Case Style: SOT-23; Operating Temperature Max: 150; Product Range: -; Automotive Qualification Standard: -; MSL: MSL 1 - Unlimited; Collector Emitter Saturation Voltage Vce(on): 200; Continuous Collector Current Ic Max: 200; Current Ic Continuous a Max: 200; Gain Bandwidth ft Min: 300; Gain Bandwidth ft Typ: 300; Operating Temperature Min: -55; Operating Temperature Range: -55°C to +150; Packaging: Cut Tape; Power Dissipation Ptot Max: 350; SMD Marking: 1; ComponentLink1URL: http://www.farnell.com/datasheets/2304127.pdf; ComponentLink1Description: http://www.farnell.com/datasheets/2304127.pdf; ComponentLink2URL: http://www.farnell.com/datasheets/1942444.pdf; ComponentLink2Description: http://www.farnell.com/datasheets/1942444.pdf; Supplier Part Number 1: 9846727
T2 T6 = DMG6602SVT: DIODES INC. - DMG6602SVT - MOSFET, NP CH, , 30V, 3.4, ATSOT23; Transistor Polarity: N and P Channel; Continuous Drain Current Id: 3.4; Drain Source Voltage Vds: 30; On Resistance Rds(on): 0.038; Rds(on) Test Voltage Vgs: 10; Threshold Voltage Vgs: 1; Power Dissipation Pd: 1.12; Transistor Case Style: TSOT-26; No. of Pins: 6; SVHC: No SVHC (17-Dec-2015); Continuous Drain Current Id, P Channel: -2.8; Drain Source Voltage Vds, P Channel: -30; Module Configuration: Dual; On Resistance Rds(on), P Channel: 0.073; Supplier 1: Farnell; Manufacturer: DIODES INC.; Manufacturer Part Number: DMG6602SVT; RoHS: YES; Stock 1: 4881; Pricing 1: 1=0.363, 25=0.339, 100=0.169, 250=0.166, 500=0.108, 1000=0.0809, 2000=0.0793, 6000=0.0777 (GBP); Operating Temperature Max: 150; Product Range: -; Automotive Qualification Standard: -; MSL: -; Continuous Drain Current Id, N Channel: 3.4; Drain Source Voltage Vds, N Channel: 30; On Resistance Rds(on), N Channel: 0.038; Operating Temperature Min: -55; Operating Temperature Range: -55°C to +150°C<!--FANDB--><div class="features-and-benefits-container"><div class="features-and-benefits-description"><span class="features-benefits-value">The DMG6602SVT from Diode Inc is a surface mount complementary pair enhancement mode MOSFET in TSOT-26 package. This MOSFET features low input capacitance, fast switching speed and low input/output leakage, designed to minimize the onstate resistance and maintain superior switching performance, making it ideal for high efficiency power management applications and backlighting.</span></div><div class="features-and-benefits-list"><ul class="features-and-benefits-list-list"><li class="features-and-benefits-list-item">Automotive grade AEC-Q101 qualified</li><li class="features-and-benefits-list-item">UL recognized</li><li class="features-and-benefits-list-item">Drain to source voltage (Vds) of 30V</li><li class="features-and-benefits-list-item">Gate to source voltage (Vgs) of ±20V</li><li class="features-and-benefits-list-item">Continuous drain current of 3.4A</li><li class="features-and-benefits-list-item">Power dissipation (Pd) of 1.27W</li><li class="features-and-benefits-list-item">Operating temperature range -55°C to 150°C</li><li class="features-and-benefits-list-item">Low on state resistance of 38mohm at Vgs of 10; ComponentLink1URL: http://www.farnell.com/datasheets/1915929.pdf; ComponentLink1Description: http://www.farnell.com/datasheets/1915929.pdf; Supplier Part Number 1: 2061522
U1 = BQ24296RGET: IC LI+ CHARGER PWR MGMT 24VQFN; Manufacturer: Texas Instruments; Battery Chemistry: Lithium-Ion/Polymer; Number of Cells: 1; Current - Charging: Constant - Programmable; Fault Protection: Over Current, Over Temperature, Over Voltage; Charge Current - Max: 3A; Battery Pack Voltage: 4.2V; Voltage - Supply (Max): 6.2V; Interface: I²C; Manufacturer Part Number: BQ24296RGET; RoHS: RoHS Compliant; Category: Integrated Circuits (ICs); Packaging: Cut Tape (CT); Part Status: Active; Programmable Features: -; Operating Temperature: -40°C ~ 85°C (TA); Package / Case: 24-VFQFN Exposed Pad; Supplier Device Package: 24-VQFN (4x4); ComponentLink1URL: http://www.ti.com/lit/ds/symlink/bq24296.pdf; ComponentLink1Description: http://www.ti.com/lit/ds/symlink/bq24296.pdf; Supplier 1: Farnell; Supplier Part Number 1: 2373541